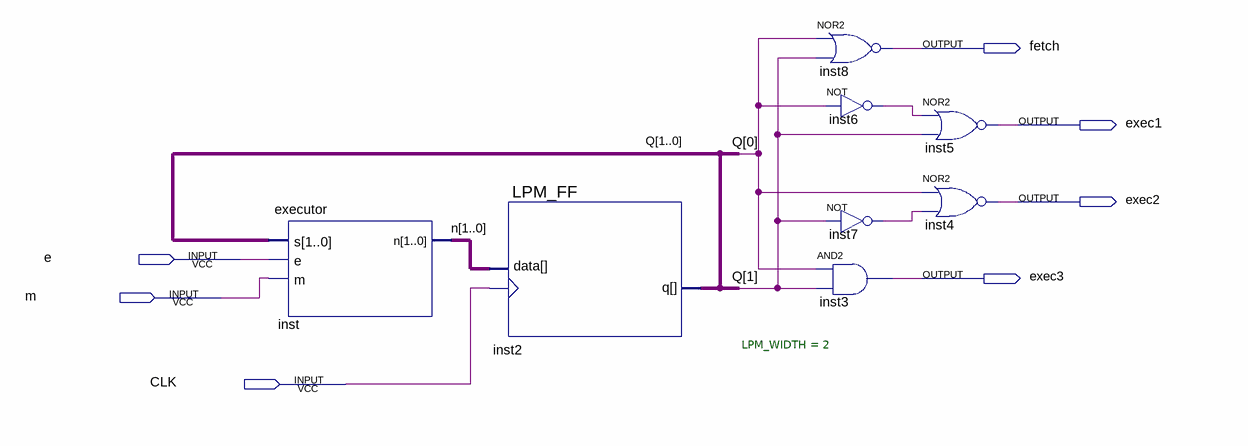
[diagram p0: schematic sheet]
// Quartus schematic StateMachine.bdf as structural Verilog: 8 symbols, 7 pins
module StateMachine (
  input  e,
  input  m,
  input  CLK,
  output fetch,
  output exec1,
  output exec2,
  output exec3
);

  wire inst6_out, inst7_out;
  wire [1:0] n, Q;

  executor inst (.s(Q), .e(e), .m(m), .n(n));
  LPM_FF #(.LPM_WIDTH(2)) inst2 (.clock(CLK), .data(n), .q(Q));
  nor inst8 (fetch, Q[0], Q[1]);
  not inst6 (inst6_out, Q[0]);
  not inst7 (inst7_out, Q[1]);
  and inst3 (exec3, Q[0], Q[1]);
  nor inst5 (exec1, inst6_out, Q[1]);
  nor inst4 (exec2, Q[0], inst7_out);
endmodule
